# Altium schematic sheet Sheet1.SchDoc
size A4; SheetNumber: 1; SheetTotal: 1
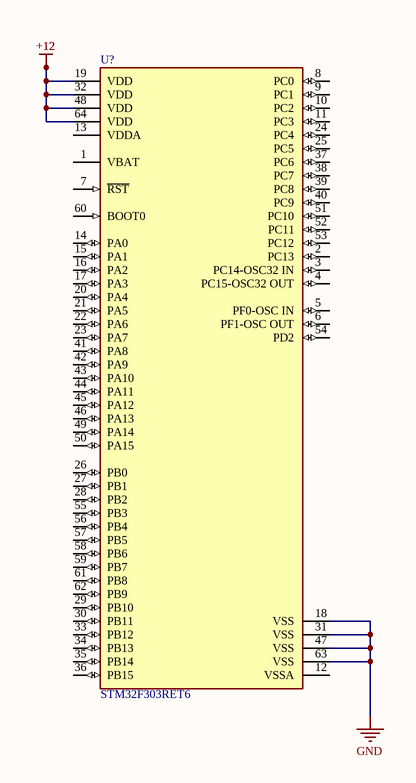
[diagram p0: Sheet1.SchDoc]

## Parts
U?  STM32F303RET6  [FP-LQFP64-5W-MFG]

## Nets
+12: U?.19(VDD) U?.32(VDD) U?.48(VDD) U?.64(VDD)
GND: U?.18(VSS) U?.31(VSS) U?.47(VSS) U?.63(VSS)

Not connected (* = marked no-connect by the designer): U? 1(VBAT) 2(PC13) 3(PC14-OSC32_IN) 4(PC15-OSC32_OUT) 5(PF0-OSC_IN) 6(PF1-OSC_OUT) 7(~{RST}) 8(PC0) 9(PC1) 10(PC2) 11(PC3) 12(VSSA) 13(VDDA) 14(PA0) 15(PA1) 16(PA2) 17(PA3) 20(PA4) 21(PA5) 22(PA6) 23(PA7) 24(PC4) 25(PC5) 26(PB0) 27(PB1) 28(PB2) 29(PB10) 30(PB11) 33(PB12) 34(PB13) 35(PB14) 36(PB15) 37(PC6) 38(PC7) 39(PC8) 40(PC9) 41(PA8) 42(PA9) 43(PA10) 44(PA11) 45(PA12) 46(PA13) 49(PA14) 50(PA15) 51(PC10) 52(PC11) 53(PC12) 54(PD2) 55(PB3) 56(PB4) 57(PB5) 58(PB6) 59(PB7) 60(BOOT0) 61(PB8) 62(PB9)

## Library data of the parts
U? = CMP-0537-00048-2: IC MCU 32BIT 512KB FLASH 64LQFP; Manufacturer: STMicroelectronics; Data Bus Width: 32bits; Standoff Height: 0.05mm; Number Of Pwm Channels: 31; Number Of Timers/Counters: 6; Min Supply Voltage: 2V; Number Of Spi Channels: 4; Core Architecture: ARM Cortex-M4; Number Of I2C Channels: 3; Number Of Usb Channels: 1; Max Supply Voltage: 3.6V; Interface: I2C,SPI,UART,USART,CAN,USB,LIN,IrDA,I2S; Frequency: 72MHz; Max Junction Temp: +105°C; Number Of Uart Channels: 2; Number Of I/Os: 26; Memory Size: 512KBytes; Number Of Adc Channels: 22; Ram Size: 80KBytes; Nominal Supply Current: 4.27-66.4mA; ComponentLink2URL: https://www.st.com/resource/en/datasheet/stm32f303re.pdf; Automotive: No; Mouser Description: MCU 32-Bit STM32 ARM Cortex M4 RISC 512KB Flash 2.5V/3.3V 64-Pin LQFP Tray; Memory Type: FLASH; Temperature: -40°C to +105°C; Temperature Range Low: -40°C; Manufacturer Part Number: STM32F303RET6; Number Of A/D Converters: 4; Ambient Temperature Range High: +85°C; RoHS: TRUE; Category: IC; Ambient Temperature Range Low: -40°C; Number Of Cores: 1; Octopart: https://octopart.com/stm32f303ret6-stmicroelectronics-53115257; Height: 1.6mm; Device Class L2: Embedded Processors and Controllers; Device Class L3: Microcontrollers; Temperature Range High: +105°C; ComponentLink2Description: Datasheet; Lead Free: Yes; Digikey Description: IC MCU 32BIT 512KB FLASH 64LQFP; Package: LQFP64-5W; Device Class L1: Integrated Circuits (ICs)